# Altium schematic sheet Cover.SchDoc
size B; Revision: B01; SheetNumber: 1; SheetTotal: 5
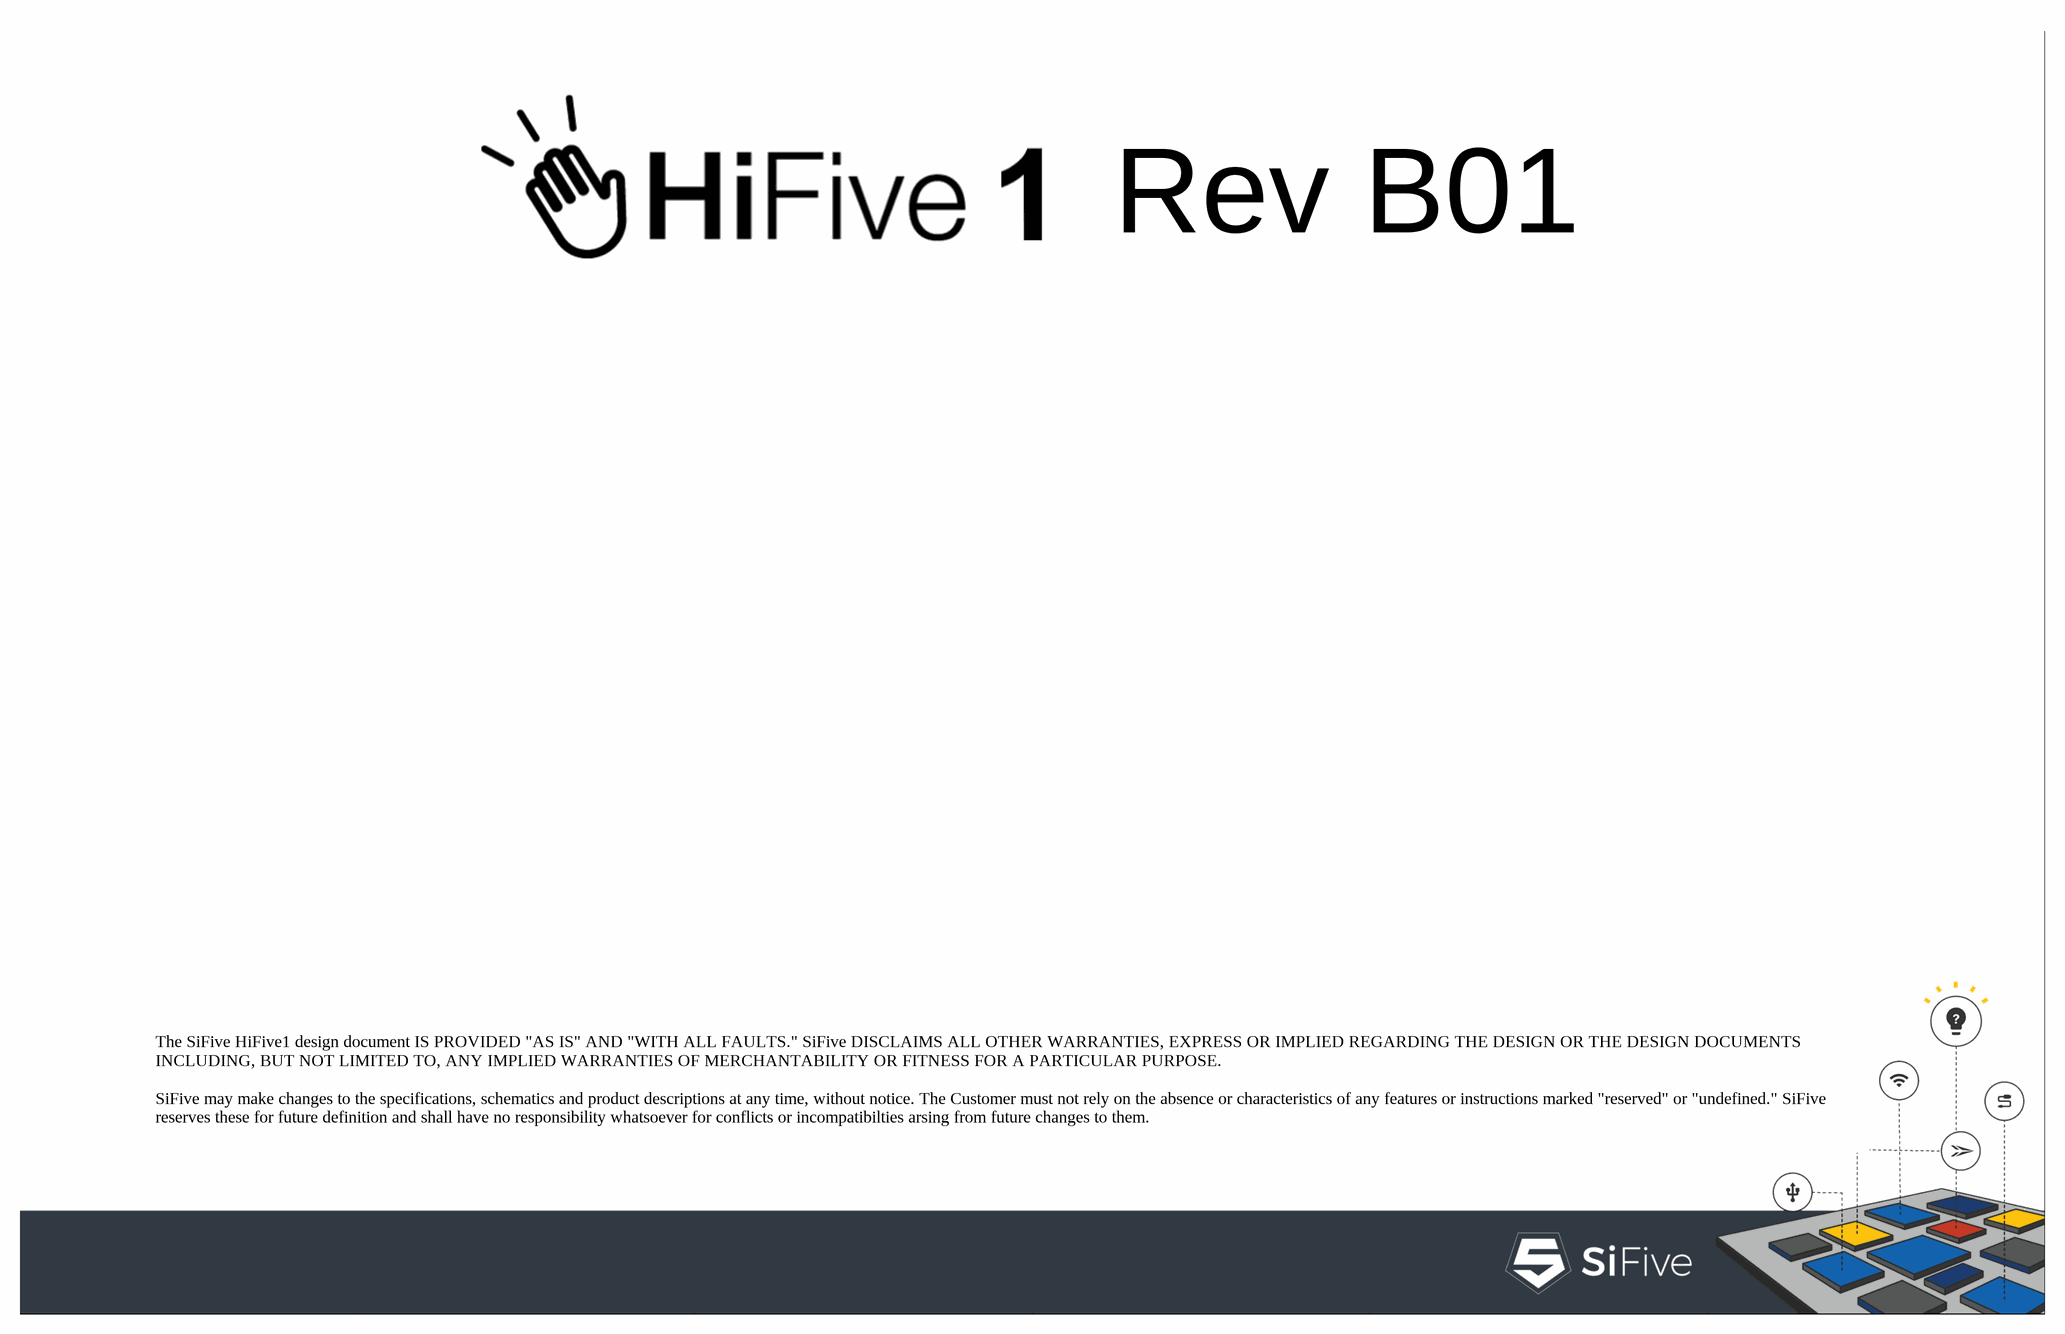
[diagram p0: Cover.SchDoc]

## Notes on the sheet
- Rev B01
- The SiFive HiFive1 design document IS PROVIDED "AS IS" AND "WITH ALL FAULTS." SiFive DISCLAIMS ALL OTHER WARRANTIES, EXPRESS OR IMPLIED REGARDING THE DESIGN OR THE DESIGN DOCUMENTS INCLUDING, BUT NOT LIMITED TO, ANY IMPLIED WARRANTIES OF MERCHANTABILITY OR FITNESS FOR A PARTICULAR PURPOSE.
  SiFive may make changes to the specifications, schematics and product descriptions at any time, without notice. The Customer must not rely on the absence or characteristics of any features or instructions marked "reserved" or "undefined." SiFive reserves these for future definition and shall have no responsibility whatsoever for conflicts or incompatibilties arsing from future changes to them.